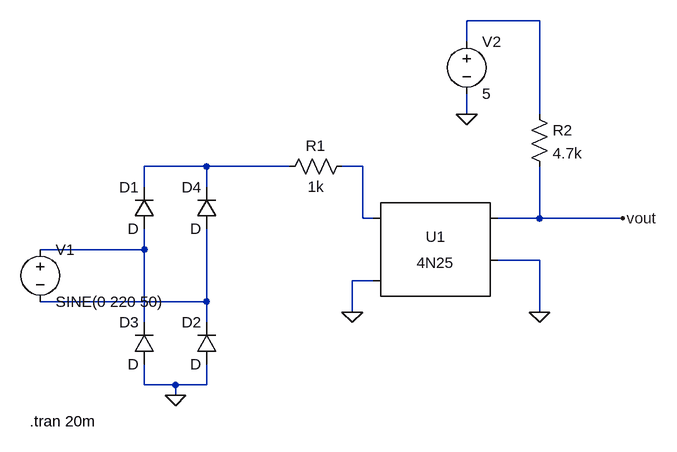
[diagram p0: schematic zero_crosing.asc]
zero_crosing.asc, the LTspice schematic file:
Version 4
SHEET 1 1108 680
WIRE 912 -208 800 -208
WIRE 800 -176 800 -208
WIRE 800 -64 800 -96
WIRE 912 -64 912 -208
WIRE 400 16 304 16
WIRE 528 16 400 16
WIRE 640 16 608 16
WIRE 304 48 304 16
WIRE 400 48 400 16
WIRE 640 96 640 16
WIRE 656 96 640 96
WIRE 912 96 912 16
WIRE 912 96 848 96
WIRE 1040 96 912 96
WIRE 304 144 304 112
WIRE 304 144 144 144
WIRE 912 160 848 160
WIRE 656 192 624 192
WIRE 400 224 400 112
WIRE 400 224 144 224
WIRE 624 240 624 192
WIRE 912 240 912 160
WIRE 304 256 304 144
WIRE 400 256 400 224
WIRE 304 352 304 320
WIRE 352 352 304 352
WIRE 400 352 400 320
WIRE 400 352 352 352
WIRE 352 368 352 352
FLAG 352 368 0
FLAG 912 240 0
FLAG 624 240 0
FLAG 1040 96 vout
FLAG 800 -64 0
SYMBOL voltage 144 128 R0
WINDOW 123 0 0 Left 0
WINDOW 39 0 0 Left 0
SYMATTR InstName V1
SYMATTR Value SINE(0 220 50)
SYMBOL diode 320 112 R180
WINDOW 0 24 64 Left 2
WINDOW 3 24 0 Left 2
SYMATTR InstName D1
SYMBOL diode 416 320 R180
WINDOW 0 24 64 Left 2
WINDOW 3 24 0 Left 2
SYMATTR InstName D2
SYMBOL diode 320 320 R180
WINDOW 0 24 64 Left 2
WINDOW 3 24 0 Left 2
SYMATTR InstName D3
SYMBOL diode 416 112 R180
WINDOW 0 24 64 Left 2
WINDOW 3 24 0 Left 2
SYMATTR InstName D4
SYMBOL res 624 0 R90
WINDOW 0 0 56 VBottom 2
WINDOW 3 32 56 VTop 2
SYMATTR InstName R1
SYMATTR Value 1k
SYMBOL Optos\\4N25 752 160 R0
SYMATTR InstName U1
SYMBOL res 896 -80 R0
SYMATTR InstName R2
SYMATTR Value 4.7k
SYMBOL voltage 800 -192 R0
WINDOW 123 0 0 Left 0
WINDOW 39 0 0 Left 0
SYMATTR InstName V2
SYMATTR Value 5
TEXT 128 408 Left 2 !.tran 20m

The netlist it stands for:
* zero_crosing.asc
V1 N004 N005 SINE(0 220 50)
D1 N004 N002 D
D2 0 N005 D
D3 0 N004 D
D4 N005 N002 D
R1 N003 N002 1k
XU1 N003 0 vout 0 NC_01 4N25
R2 N001 vout 4.7k
V2 N001 0 5
.model D D
.lib standard.dio
.tran 20m
.lib 4N25.sub
.backanno
.end